# EAGLE design guac_v2 (EAGLE 6.5.0)
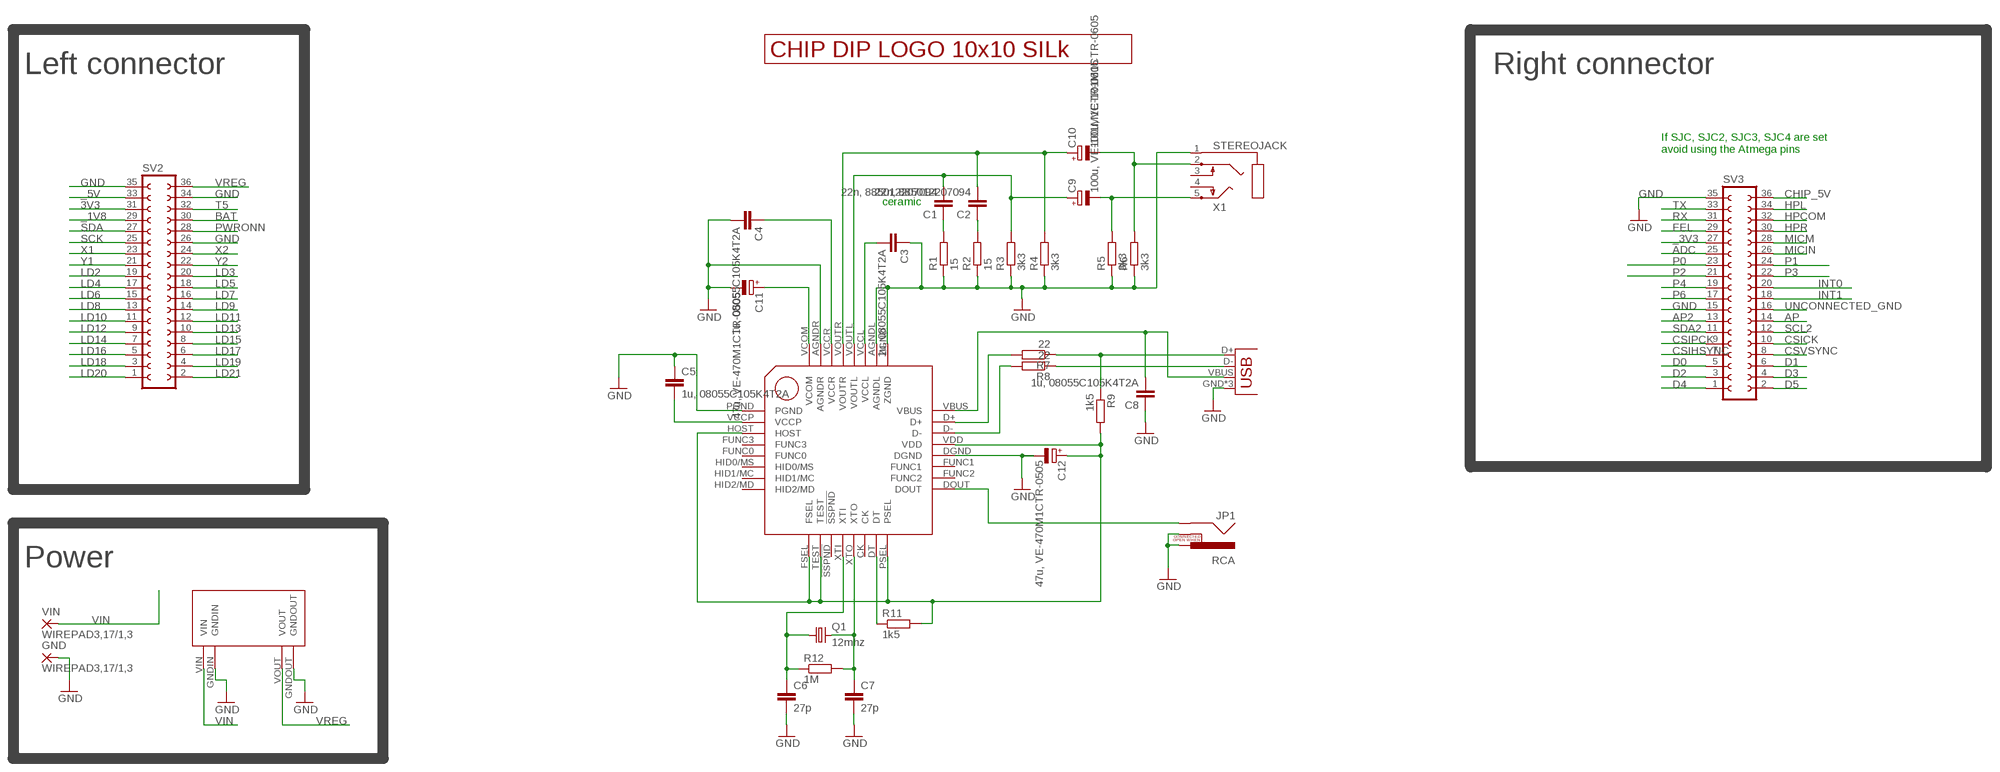
[diagram p0: schematic, sheet 1]

## Parts
C1  22n, 885012207094  C-EUC0805  [C0805]
C2  22n, 885012207094  C-EUC0805  [C0805]
C3  1u, 08055C105K4T2A  C-EUC0805  [C0805]
C4  1u, 08055C105K4T2A  C-EUC0805  [C0805]
C5  1u, 08055C105K4T2A  C-EUC0805  [C0805]
C6  27p  C-EUC0805  [C0805]
C7  27p  C-EUC0805  [C0805]
C8  1u, 08055C105K4T2A  C-EUC0805  [C0805]
C9  100u, VE-101M1CTR-0605  CPOL-EU140CLH-0810  [140CLH-0810]
C10  100u, VE-101M1CTR-0605  CPOL-EU140CLH-0810  [140CLH-0810]
C11  47u, VE-470M1CTR-0505  CPOL-EU140CLH-0810  [140CLH-0810]
C12  47u, VE-470M1CTR-0505  CPOL-EU140CLH-0810  [140CLH-0810]
GND  WIREPAD3,17/1,3  [3,17/1,3]
JP1  RCA  [RCA]
Q1  12mhz  CRYSTALHC49UP  [HC49UP]
R1  15  R-EU_M0805  [M0805]
R2  15  R-EU_M0805  [M0805]
R3  3k3  R-EU_M0805  [M0805]
R4  3k3  R-EU_M0805  [M0805]
R5  3k3  R-EU_M0805  [M0805]
R6  3k3  R-EU_M0805  [M0805]
R7  22  R-EU_M0805  [M0805]
R8  22  R-EU_M0805  [M0805]
R9  1k5  R-EU_M0805  [M0805]
R11  1k5  R-EU_M0805  [M0805]
R12  1M  R-EU_M0805  [M0805]
SV2  FE18-2  [FE18-2]
SV3  FE18-2  [FE18-2]
U$1  PCM2706  [TQFP32-08]
U$3  LOGO_10X10_SILK  [LOGO_10X10_SILK]
U$9  MP1584EN_FRAMELESS  [MP1584EN_FRAMELESS]
USB  USBUSB-MICROB-SMT-DIP  [USB-MICROB-SMT-DIP]
VIN  WIREPAD3,17/1,3  [3,17/1,3]
X1  STEREOJACK  [STX3100]

## Nets
3V3: SV2.31
_1V8: SV2.29
_3V3: SV3.27
_5V: SV2.33
ADC: SV3.25
AP: SV3.14
AP2: SV3.13
BAT: SV2.30
CHIP_5V: SV3.36
CSICK: SV3.10
CSIHSYNC: SV3.7
CSIPCK: SV3.9
CSVSYNC: SV3.8
D0: SV3.5
D1: SV3.6
D2: SV3.3
D3: SV3.4
D4: SV3.1
D5: SV3.2
FEL: SV3.29
GND: C3.1 C4.2 C5.1 C6.2 C7.2 C8.1 C11.- C12.- GND.1(P) JP1.PIN JP1.SWITCH R1.1 R2.1 R3.1 R4.1 R5.1 R6.1 SV2.26 SV2.34 SV2.35 SV3.15 SV3.35 U$1.AGNDL U$1.AGNDR U$1.DGND U$1.PGND U$1.ZGND U$9.GNDIN U$9.GNDOUT USB.GND USB.MT1(GND) USB.MT2(GND) X1.1
HPCOM: SV3.32
HPL: SV3.34
HPR: SV3.30
INT0: SV3.20
INT1: SV3.18
LD2: SV2.19
LD3: SV2.20
LD4: SV2.17
LD5: SV2.18
LD6: SV2.15
LD7: SV2.16
LD8: SV2.13
LD9: SV2.14
LD10: SV2.11
LD11: SV2.12
LD12: SV2.9
LD13: SV2.10
LD14: SV2.7
LD15: SV2.8
LD16: SV2.5
LD17: SV2.6
LD18: SV2.3
LD19: SV2.4
LD20: SV2.1
LD21: SV2.2
MICIN: SV3.26
MICM: SV3.28
N$1: C8.2 U$1.VBUS USB.VBUS
N$2: R7.2 U$1.D+
N$3: R7.1 R9.1 USB.D+
N$4: R8.2 U$1.D-
N$5: R8.1 USB.D-
N$6: JP1.SHELL U$1.DOUT
N$7: R11.1 U$1.DT
N$9: C7.1 Q1.2 R12.2 U$1.XTO
N$10: C6.1 Q1.1 R12.1 U$1.XTI
N$11: C2.1 R2.2
N$12: C5.2 U$1.VCCP
N$13: C1.2 C9.+ R3.2 U$1.VOUTL
N$14: C11.+ U$1.VCOM
N$15: C2.2 C10.+ R4.2 U$1.VOUTR
N$16: C4.1 U$1.VCCR
N$17: C9.- R5.2 X1.5
N$18: C1.1 R1.2
N$19: C10.- R6.2 X1.2
N$20: C3.2 U$1.VCCL
P0: SV3.23
P1: SV3.24
P2: SV3.21
P3: SV3.22
P4: SV3.19
P6: SV3.17
PWRONN: SV2.28
RX: SV3.31
SCK: SV2.25
SCL2: SV3.12
SDA: SV2.27
SDA2: SV3.11
T5: SV2.32
TX: SV3.33
UNCONNECTED_GND: SV3.16
VCC: C12.+ R9.2 R11.2 U$1.FSEL U$1.HOST U$1.PSEL U$1.TEST U$1.VDD
VIN: U$9.VIN VIN.1(P)
VREG: SV2.36 U$9.VOUT
X1: SV2.23
X2: SV2.24
Y1: SV2.21
Y2: SV2.22
Unconnected: U$1.!SSPND U$1.CK U$1.FUNC0 U$1.FUNC1 U$1.FUNC2 U$1.FUNC3 U$1.HID0/MS U$1.HID1/MC U$1.HID2/MD X1.3 X1.4

## Notes on the sheet
- Left connector | Right connector
- If SJC, SJC2, SJC3, SJC4 are set 
  avoid using the Atmega pins
- ceramic
- Power

## Library data of the parts
C1-C8 = rcl:C-EU: CAPACITOR, European symbol
C9-C12 = rcl:CPOL-EU: POLARIZED CAPACITOR, European symbol
GND VIN = wirepad:WIREPAD: Wire PAD connect wire on PCB
JP1 = SparkFun-Connectors:RCA
Q1 = crystal:CRYSTAL: CRYSTAL; OC_FARNELL: unknown; OC_NEWARK: unknown
R1-R9 R11 R12 = rcl:R-EU_: RESISTOR, European symbol
SV2 SV3 = con-lsta:FE18-2: FEMALE HEADER; OC_FARNELL: unknown; OC_NEWARK: unknown
U$1 = pcm2706:PCM2706: Texas Instruments' Audio Dac.
U$3 = logo:LOGO_10X10_SILK
U$9 = power_supply:MP1584EN_FRAMELESS
USB = Spark:USB
X1 = adafruit:STEREOJACK: MIC/HEADPHONE JACK Stereo jack with two switches. Kycon STX3100, CUI SJ1-3555NG and/or 4UCon 05544

## Board
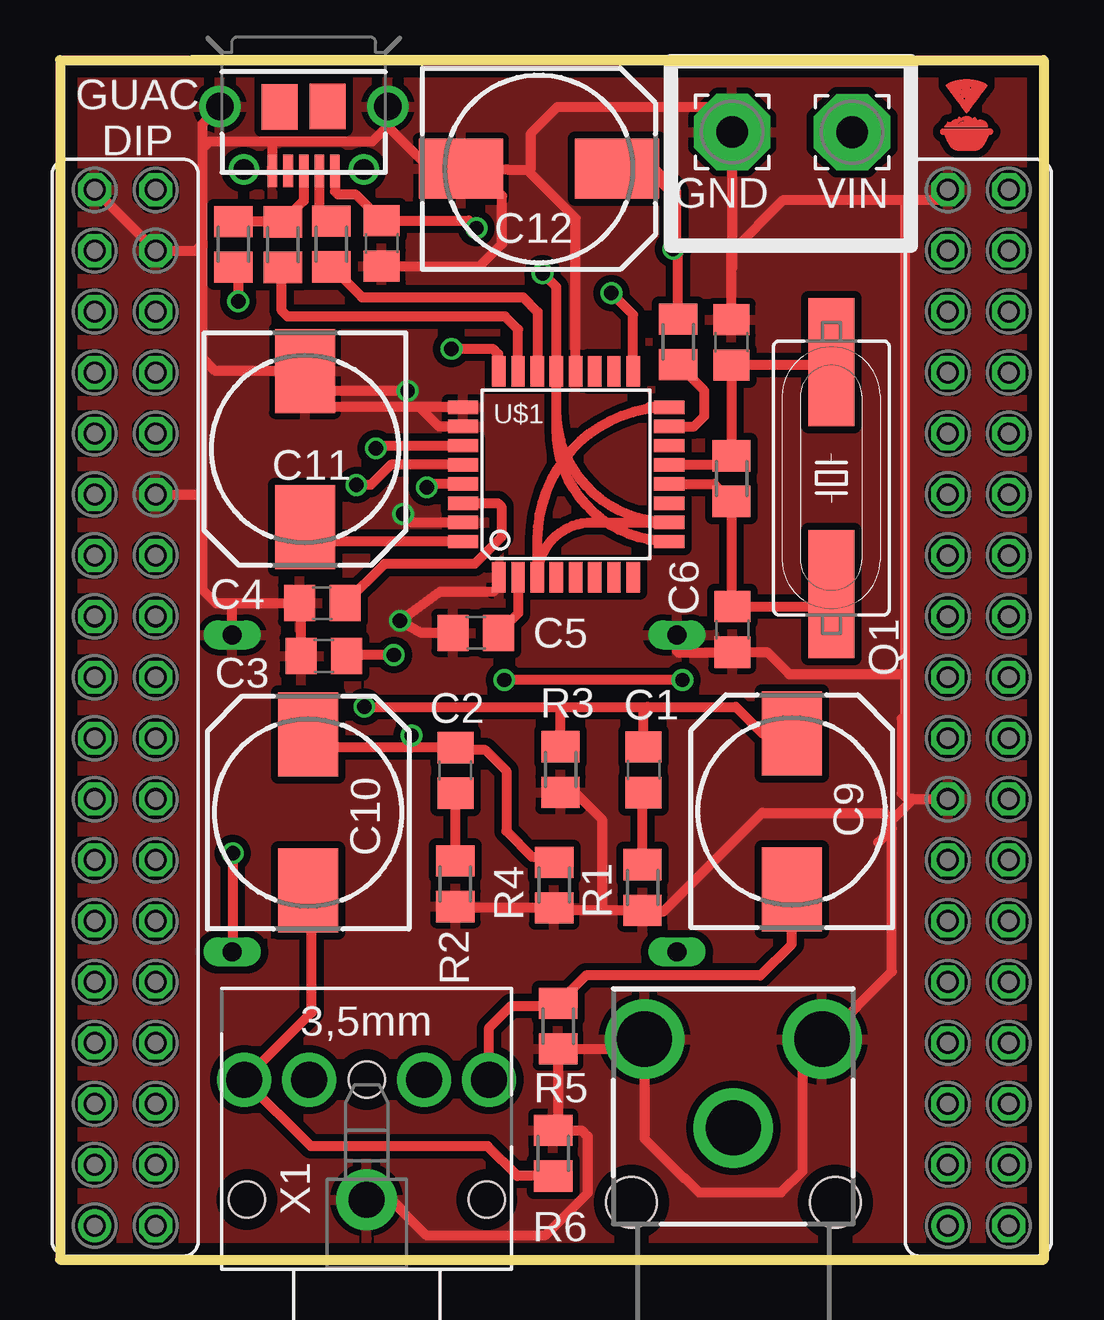
[diagram p1: board, top side]
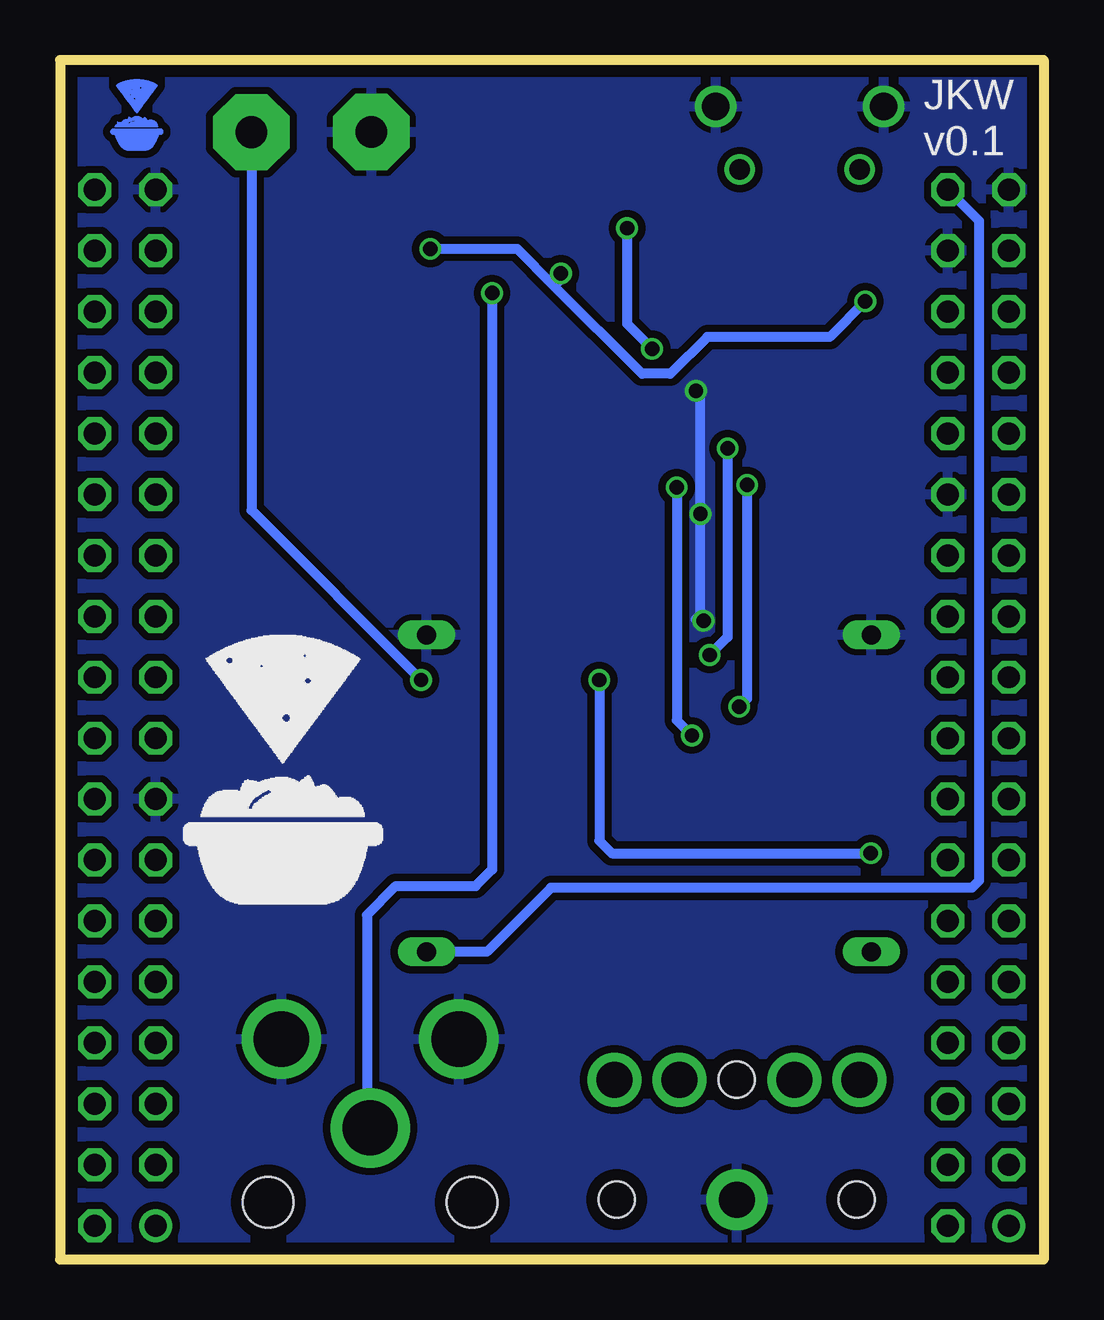
[diagram p2: board, bottom side, seen from below]

Size 41 x 50 mm. Coordinates in mm from the lower left corner, seen from the top.
Outline: 0,50 41,50 41,0 0,0 0,50
Copper layers (1*16): Top 0.035mm / dielectric 1.6mm / Bottom 0.035mm
Design rules "Elecrow_2-layer_PCB_eagle_rule": minimum track width 6mil, minimum drill 12mil, track to track 6mil, track to pad 6mil, pad to pad 6mil, via to via 8mil, smd to smd 0mil, copper to edge 20mil, drill to drill 10mil, minimum pad ring 6mil, minimum via ring 6mil, stop-mask expansion 0mil, vias tented up to drill 100mil, thermal gap 10mil

### Footprints (pad centres in the part's own frame; a part is rotated, then mirrored left to right if it is on the bottom)
C0805 = smd 1.3 x 1.5: 1 -0.95,0; 2 0.95,0
140CLH-0810 = smd 3.5 x 2.5: + 3.25,0; - -3.25,0
3,17/1,3 = drill 1.321 pad 3.175 octagon: 1 0,0
RCA = drill 2.3: PIN 3.7,3.7; SHELL 0,0; SWITCH 3.7,-3.7 | hole 2.1: -3.1,4.25; -3.1,-4.25
HC49UP = smd 5.334 x 1.93: 1 -4.826,0; 2 4.826,0
M0805 = smd 1.3 x 1.6: 1 -0.95,0; 2 0.95,0
FE18-2 = drill 0.914: 1 -21.59,1.27 | drill 0.914 octagon: 2 -21.59,-1.27; 3 -19.05,1.27; 4 -19.05,-1.27; 5 -16.51,1.27; 6 -16.51,-1.27; 7 -13.97,1.27; 8 -13.97,-1.27; 9 -11.43,1.27; 10 -11.43,-1.27; 11 -8.89,1.27; 12 -8.89,-1.27; 13 -6.35,1.27; 14 -6.35,-1.27; 15 -3.81,1.27; 16 -3.81,-1.27; 17 -1.27,1.27; 18 -1.27,-1.27; 19 1.27,1.27; 20 1.27,-1.27; 21 3.81,1.27; 22 3.81,-1.27; 23 6.35,1.27; 24 6.35,-1.27; 25 8.89,1.27; 26 8.89,-1.27; 27 11.43,1.27; 28 11.43,-1.27; 29 13.97,1.27; 30 13.97,-1.27; 31 16.51,1.27; 32 16.51,-1.27; 33 19.05,1.27; 34 19.05,-1.27; 35 21.59,1.27; 36 21.59,-1.27
TQFP32-08 = smd 1.27 x 0.559: !SSPND 4.293,-1.2; AGNDL -4.293,2; AGNDR -4.293,-2; CK 4.293,1.2; DT 4.293,2; FSEL 4.293,-2.8; PSEL 4.293,2.8; TEST 4.293,-2; VCCL -4.293,1.2; VCCR -4.293,-1.2; VCOM -4.293,-2.8; VOUTL -4.293,0.4; VOUTR -4.293,-0.4; XTI 4.293,-0.4; XTO 4.293,0.4; ZGND -4.293,2.8 | smd 0.559 x 1.27: D+ -2,4.293; D- -1.2,4.293; DGND 0.4,4.293; DOUT 2.8,4.293; FUNC0 0.4,-4.293; FUNC1 1.2,4.293; FUNC2 2,4.293; FUNC3 -0.4,-4.293; HID0/MS 1.2,-4.293; HID1/MC 2,-4.293; HID2/MD 2.8,-4.293; HOST -1.2,-4.293; PGND -2.8,-4.293; VBUS -2.8,4.293; VCCP -2,-4.293; VDD -0.4,4.293
MP1584EN_FRAMELESS = drill 0.8 long: GNDIN 1.778,14.986; GNDOUT 20.32,14.986; VIN 1.778,1.778; VOUT 20.32,1.778
USB-MICROB-SMT-DIP = smd 0.4 x 1.35: D+ 0,2.675; D- -0.65,2.675; GND 1.3,2.675; ID 0.65,2.675; VBUS -1.3,2.675 | drill 1.15 pad 1.7: MT1 -3.5,0; MT2 3.5,0 | drill 0.85 pad 1.25: MT3 -2.5,2.625; MT4 2.5,2.625 | smd 1.5 x 1.9: P$1 -1,0; P$2 1,0.01
STX3100 = drill 1.5 pad 2.54: 1 2.7,-0.1 | drill 1.5: 2 7.7,5; 3 7.7,2.3; 4 7.7,-2.5; 5 7.7,-5.2 | hole 1.5: 2.7,4.9; 2.7,-5.1; 7.7,-0.1

### Placement (x,y rotation side)
C1  24.33,20.41 90 top
C2  16.48,20.38 90 top
C3  11,25.16 0 top
C4  10.93,27.36 180 top
C5  17.34,26.12 0 top
C6  28.03,26.26 270 top
C7  27.99,38.23 90 top
C8  13.41,42.35 90 top
C9  30.51,18.68 90 top
C10  10.35,18.63 90 top
C11  10.21,33.78 270 top
C12  19.96,45.47 0 top
GND  28.02,47 180 top
JP1  28.07,5.49 90 top
Q1  32.16,32.58 90 top
R1  24.28,15.51 90 top
R2  16.48,15.66 90 top
R3  20.87,20.42 90 top
R4  20.6,15.61 90 top
R5  20.76,9.73 90 top
R6  20.56,4.43 270 top
R7  9.28,42.3 270 top
R8  11.32,42.33 270 top
R9  7.23,42.32 270 top
R11  25.77,38.25 90 top
R12  27.99,32.55 90 top
SV2  2.72,23 90 top
SV3  38.28,23 90 top
U$1  21.09,32.73 0 top
U$2  LOGO  [LOGO]  36.5,46.1 0 top
U$3  35.88,14.8 0 bottom
U$5  LOGO  [LOGO]  39.09,46.1 0 bottom
U$9  5.4,11.05 0 top
USB  10.16,48.06 180 top
VIN  33.02,46.99 180 top
X1  12.69,-0.2 90 top

### Tracks (layer width: path | path; a pad name or v marks a point on that pad's centre or on a via)
GND  (via drill 0.6)
  Top 0.406: 5.94,32 5.94,27.91 6.5,27.36 6.99,27.36 | 5.94,32 5.94,37.57 | 5.94,37.57 5.94,42.34 | SV2.26 5.83,31.89 5.94,32 | 5.94,37.57 6.48,37.03 C11.- 10.45,36.79 10.45,36.58 | 5.94,42.34 5.65,42.05 SV2.34 SV2.35 | 17.31,45.45 C12.- 15.43,45.47 13.66,47.24 | 17.31,45.45 18.63,45.43 19.53,45.43 arc90 19.62,45.52 | U$1.ZGND 15,35.53 | 15,35.53 11.23,35.53 10.45,36.31 10.45,36.58 | U$1.AGNDR 14.65,30.73 v14.3,31.08 | v14.49,36.21 10.82,36.21 10.45,36.58 | 35.57,19.19 SV3.15 | C5.1 15.06,26.12 v14.17,26.62 15.82,27.83 18.05,27.83 18.3,28.07 U$1.PGND | U$1.DGND 21.5,43.4 19.62,45.28 19.62,45.52 | C7.2 27.99,41.3 | 27.99,41.3 27.99,42 30.16,44.17 35.28,44.17 | 35.28,44.17 36.59,44.17 SV3.35 | 35.09,22.54 35.09,19.43 35.23,19.29 | 34.68,17.96 34.68,12 31.87,9.19 JP1.SWITCH 30.96,8.38 30.96,3.7 30.06,2.79 26.64,2.79 26.04,3.4 26,3.4 24.37,5.03 JP1.PIN 23.96,8.78 R5.1 20.77,5.58 R6.1 21.76,5.38 22,5.14 22,2.77 20.24,1.02 15.27,1.02 14.12,2.16 | 34.68,17.96 34.68,18.3 | 34.68,18.3 35.57,19.19 | 35.23,19.29 35.23,24.47 | 35.23,24.47 35.23,44.12 35.28,44.17 | X1.1 13.85,2.5 14.29,2.06 | 34.11,17.39 34.68,17.96 | 22.55,14.56 R1.1 24.74,14.51 25.15,14.51 29.26,18.62 34.37,18.62 34.68,18.3 | 22.55,14.56 20.7,14.56 R4.1 16.54,14.66 R2.1 | R3.1 21.47,19.47 22.59,18.35 22.59,14.6 22.55,14.56 | 35.57,19.19 35.33,19.19 35.23,19.29 | U$1.AGNDL 15.8,34.73 15,35.53 | 6.99,27.36 C4.2 10.05,27.29 C3.1 | 35.23,24.47 35.15,24.4 30.4,24.4 29.49,25.31 C6.2 28.01,25.3 25.79,25.3 25.72,25.38 U$9.GNDOUT | U$9.GNDIN 7.18,27.16 6.99,27.36 | C8.1 17.49,41.4 18.43,42.34 18.43,44.34 17.31,45.45 | 5.94,42.34 5.94,46.32 | 5.94,46.32 5.94,47.34 USB.MT2
  Top 0.406: USB.MT1 13.66,47.24 | 13.66,47.24 13.02,46.6 8.85,46.6 | 8.85,46.6 6.22,46.6 5.94,46.32 | USB.GND 8.86,46.59 8.85,46.6 | 27.99,41.3 28.02,41.33 GND.1 26.99,48.03 20.73,48.03 19.62,46.93 19.62,45.52
  Bottom 0.406: v14.17,26.62 14.49,26.7 14.3,26.89 v14.3,31.08 14.3,36.02 v14.49,36.21 | SV3.35
  pour Top (isolate 0.305, rank 2): -0.07,0.25 40.88,0.25 41.01,10.57 41.01,50.01 0,50.01 0,10.47
  pour Bottom (isolate 0.305): 0,50 41.05,50 41.05,0.25 0.02,0.25 0.02,49.92
N$1  (via drill 0.6)
  Top 0.406: 17.1,43.25 v17.36,42.99 17.05,43.3 C8.2 12.32,44.4 11.58,44.4 11.46,44.52 USB.VBUS | v16.32,37.96 18.05,37.96 18.26,37.74 18.26,37.05 U$1.VBUS
  Bottom 0.406: v17.36,42.99 17.36,39 v16.32,37.96
N$2
  Top 0.406: U$1.D+ 19.09,38.77 18.55,39.31 9.49,39.31 9.25,39.55 9.25,41.32 R7.2
N$3
  Top 0.406: USB.D+ 10.16,44.13 R7.1 7.24,43.25 R9.1
N$4
  Top 0.406: U$1.D- 19.91,37.04 19.91,39.5 19.3,40.11 12.59,40.11 R8.2
N$5
  Top 0.406: USB.D- 10.81,43.78 R8.1
N$6  (via drill 0.6)
  Top 0.406: U$1.DOUT 23.89,39.38 v22.99,40.28
  Bottom 0.406: v22.99,40.28 22.99,16.26 23.67,15.57 27,15.57 28.21,14.36 28.21,5.63 JP1.SHELL
N$7
  Top 0.406: U$1.DT 26.43,34.73 26.86,35.15 26.86,36.21 R11.1
N$9
  Top 0.406: U$1.XTO 27.62,33.13 R12.2 C7.1 31.51,37.28 Q1.2
N$10
  Top 0.406: U$1.XTI 27.26,32.33 R12.1 27.99,27.7 | 27.99,27.7 27.99,27.25 C6.1 31.62,27.21 Q1.1 | 27.99,27.7 27.94,27.65 27.94,27.09
N$11
  Top 0.406: R2.2 C2.1
N$12
  Top 0.406: U$1.VCCP 19.09,26.93 C5.2
N$13  (via drill 0.6)
  Top 0.406: U$1.VOUTL 13.8,33.13 12.95,32.28 v12.36,32.28 | v12.69,23.04 20.79,23.04 | 20.79,23.04 24.5,23.04 | 24.5,23.04 28.17,23.04 29.27,21.93 C9.+ | R3.2 20.87,22.96 20.79,23.04 | C1.2 24.33,22.87 24.5,23.04
  Bottom 0.406: v12.36,32.28 12.36,23.37 v12.69,23.04
N$14
  Top 0.406: U$1.VCOM 10.81,29.93 C11.+
N$15  (via drill 0.6)
  Top 0.406: R4.2 19.67,16.79 18.61,17.86 18.61,20.36 17.73,21.23 16.58,21.23 C2.2 14.66,21.33 | 14.66,21.33 11.09,21.33 C10.+ | U$1.VOUTR 15.44,32.33 v15.29,32.18 | v14.66,21.84 14.66,21.33
  Bottom 0.406: v15.29,32.18 15.29,22.48 v14.66,21.84
N$16
  Top 0.406: U$1.VCCR 18.26,31.53 18.4,31.38 18.4,30.11 17.29,28.99 13.52,28.99 C4.1
N$17
  Top 0.406: X1.5 17.89,9.66 18.8,10.57 20.65,10.57 R5.2 21.92,11.84 29.2,11.84 30.5,13.14 C9.-
N$18
  Top 0.406: R1.2 24.28,19.41 C1.1
N$19
  Top 0.406: R6.2 19.07,3.48 17.83,4.72 10.46,4.72 X1.2 10.49,10.3 10.49,13.96 C10.-
N$20  (via drill 0.6)
  Top 0.406: v13.17,33.81 13.29,33.93 U$1.VCCL | v13.92,25.2 11.99,25.2 C3.2
  Bottom 0.406: v13.17,33.81 13.17,25.95 v13.92,25.2
VCC  (via drill 0.6)
  Top 0.406: R9.2 7.43,41.33 v7.43,39.94 | v20.12,41.11 20.7,40.53 U$1.VDD 20.7,35.42 | R11.2 25.77,41.92 v25.57,42.13 | 24.54,35.53 U$1.PSEL arc90 19.89,30.04 U$1.HOST arc-90 22.19,30.73 U$1.TEST arc-90 20.7,35.42 | U$1.FSEL arc-90 20.7,34.62 20.7,35.42
  Top 0.61: C12.+ 24.62,45.47 25.59,44.5 25.59,42.15 v25.57,42.13
  Bottom 0.406: v7.43,39.94 8.91,38.46 14.02,38.46 15.56,36.92 16.74,36.92 20.4,40.58 | 20.4,40.58 21.95,42.13 v25.57,42.13 | v20.12,41.11 20.12,40.86 20.4,40.58
VIN  (via drill 0.6)
  Top 0.406: v25.95,24.16 v18.52,24.16 | v7.2,16.94 7.2,12.85 U$9.VIN
  Bottom 0.406: VIN.1 33.02,31.23 v25.95,24.16 | v18.52,24.16 18.52,17.45 18,16.93 7.21,16.93 v7.2,16.94
VREG
  Bottom 0.406: SV2.36 2.69,43.29 2.69,15.79 2.98,15.49 20.54,15.49 23.2,12.83 U$9.VOUT

### Text on the board
tNames: GUAC / DIP
bNames: JKW / v0.1